# Altium schematic sheet power_load.SchDoc
size A2; SheetNumber: 1; SheetTotal: 2
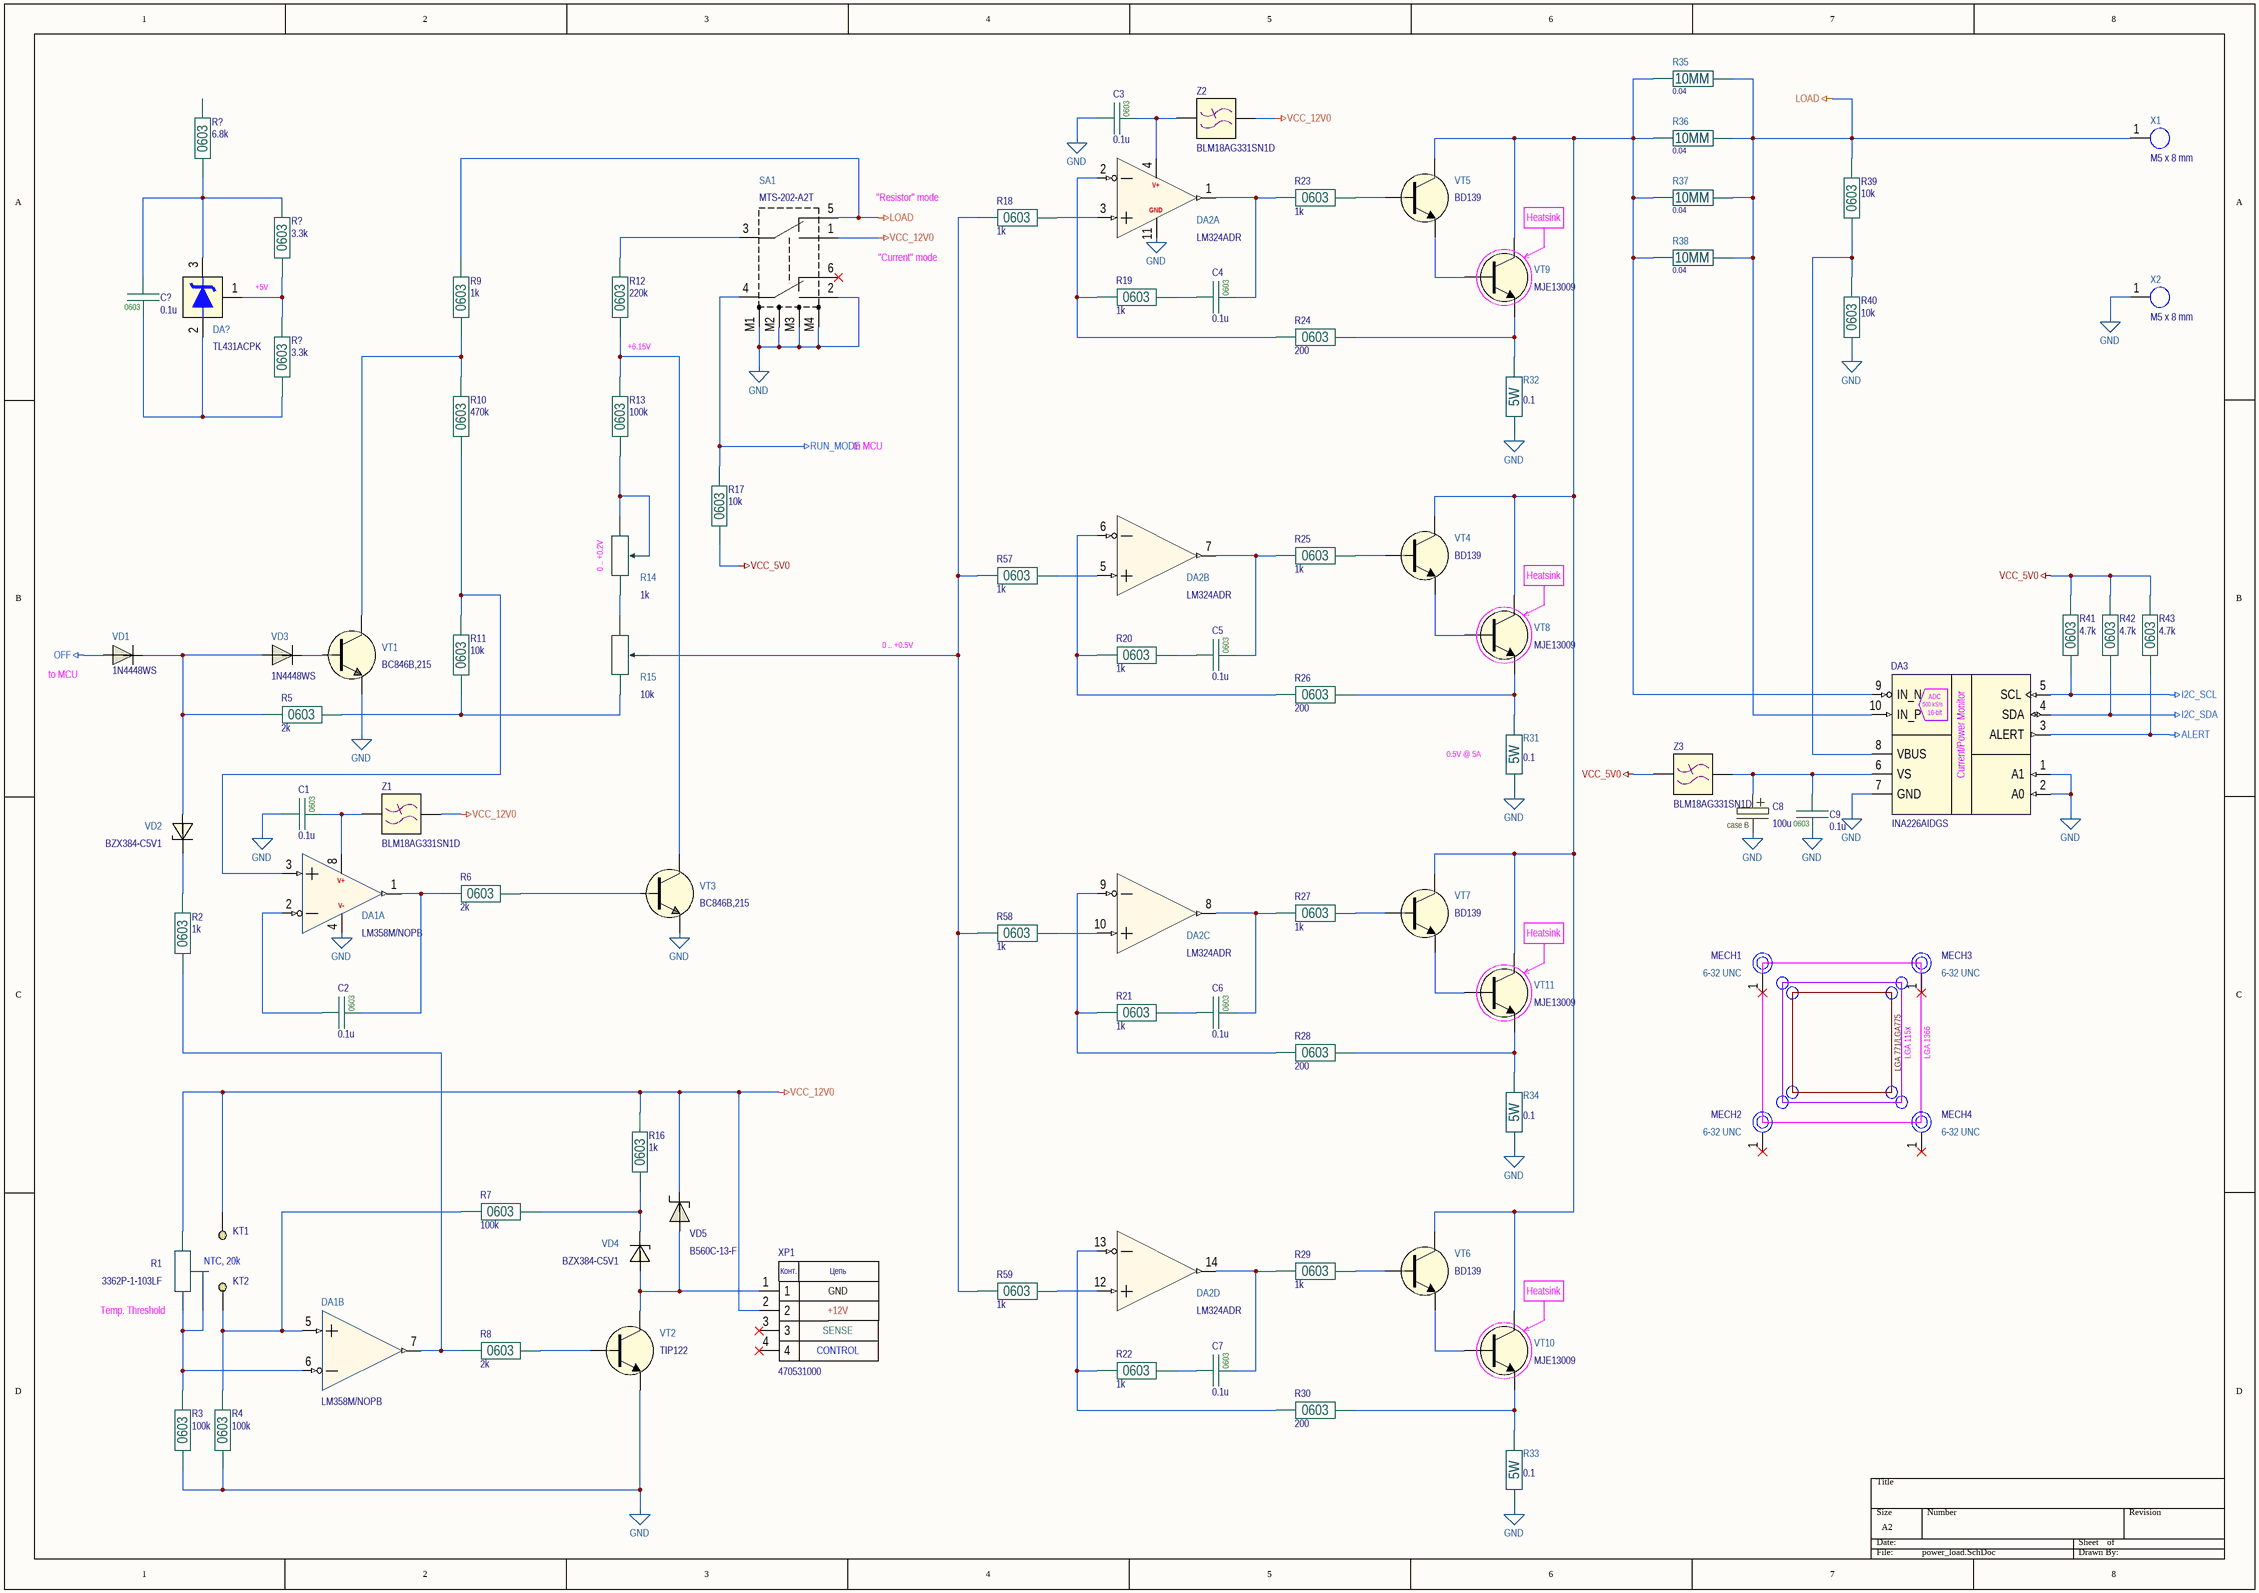
[diagram p0: power_load.SchDoc]

## Parts
(Parts that share a designator on the sheet are numbered #1, #2 ... from top to bottom, then left to right.)
C1  0.1u  Package: 0603  [CAP0603]
C2  0.1u  Package: 0603  [CAP0603]
C3  0.1u  Package: 0603  [CAP0603]
C4  0.1u  Package: 0603  [CAP0603]
C5  0.1u  Package: 0603  [CAP0603]
C6  0.1u  Package: 0603  [CAP0603]
C7  0.1u  Package: 0603  [CAP0603]
C8  100u  Package: case B  [CAP_CASE_B]
C9  0.1u  Package: 0603  [CAP0603]
C?  0.1u  Package: 0603  [CAP0603]
DA1  LM358M/NOPB  [SOIC-8]  (parts A,B of 2)
DA2  LM324ADR  [SOIC-14]  (parts A,B,C,D of 4)
DA3  INA226AIDGS  [VSSOP-10]
DA?  TL431ACPK  [SOT89-3]
KT1  TEST_PAD  [TEST_PAD_HOLE1.1x1.8]  (value not drawn)  (net tie, no BOM)
KT2  TEST_PAD  [TEST_PAD_HOLE1.1x1.8]  (value not drawn)  (net tie, no BOM)
MECH1  Thread: 6-32 UNC  [1612-2_SLOT]  (hidden comment: 1612-2)
MECH2  Thread: 6-32 UNC  [1612-2_SLOT]  (hidden comment: 1612-2)
MECH3  Thread: 6-32 UNC  [1612-2_SLOT]  (hidden comment: 1612-2)
MECH4  Thread: 6-32 UNC  [1612-2_SLOT]  (hidden comment: 1612-2)
R1  3362P-1-103LF  [3362P]
R2  1k  Package: 0603  [RES0603B]
R3  100k  Package: 0603  [RES0603B]
R4  100k  Package: 0603  [RES0603B]
R5  2k  Package: 0603  [RES0603B]
R6  2k  Package: 0603  [RES0603B]
R7  100k  Package: 0603  [RES0603B]
R8  2k  Package: 0603  [RES0603B]
R9  1k  Package: 0603  [RES0603B]
R10  470k  Package: 0603  [RES0603B]
R11  10k  Package: 0603  [RES0603B]
R12  220k  Package: 0603  [RES0603B]
R13  100k  Package: 0603  [RES0603B]
R14  value 1k  [PTV09A-4225F]  (hidden comment: PTV09A-4225F-B102)
R15  value 10k  [PTV09A-4225F]  (hidden comment: PTV09A-4225F-B103)
R16  1k  Package: 0603  [RES0603B]
R17  10k  Package: 0603  [RES0603C]
R18  1k  Package: 0603  [RES0603B]
R19  1k  Package: 0603  [RES0603B]
R20  1k  Package: 0603  [RES0603B]
R21  1k  Package: 0603  [RES0603B]
R22  1k  Package: 0603  [RES0603B]
R23  1k  Package: 0603  [RES0603B]
R24  200  Package: 0603  [RES0603B]
R25  1k  Package: 0603  [RES0603B]
R26  200  Package: 0603  [RES0603B]
R27  1k  Package: 0603  [RES0603B]
R28  200  Package: 0603  [RES0603B]
R29  1k  Package: 0603  [RES0603B]
R30  200  Package: 0603  [RES0603B]
R31  0.1  Package: 5W  [BPR58_HORIZONTAL]
R32  0.1  Package: 5W  [BPR58_HORIZONTAL]
R33  0.1  Package: 5W  [BPR58_HORIZONTAL]
R34  0.1  Package: 5W  [BPR58_HORIZONTAL]
R35  0.04  Package: 10MM  [CURRENT_SENSE_10x11mm]
R36  0.04  Package: 10MM  [CURRENT_SENSE_10x11mm]
R37  0.04  Package: 10MM  [CURRENT_SENSE_10x11mm]
R38  0.04  Package: 10MM  [CURRENT_SENSE_10x11mm]
R39  10k  Package: 0603  [RES0603C]
R40  10k  Package: 0603  [RES0603C]
R41  4.7k  Package: 0603  [RES0603B]
R42  4.7k  Package: 0603  [RES0603B]
R43  4.7k  Package: 0603  [RES0603B]
R57  1k  Package: 0603  [RES0603B]
R58  1k  Package: 0603  [RES0603B]
R59  1k  Package: 0603  [RES0603B]
R?#1  6.8k  Package: 0603  [RES0603B]
R?#2  3.3k  Package: 0603  [RES0603B]
R?#3  3.3k  Package: 0603  [RES0603B]
SA1  MTS-202-A2T  [MTS-202-A2T]
VD1  1N4448WS  [SOD-323F]
VD2  BZX384-C5V1  [SOD-323]
VD3  1N4448WS  [SOD-323F]
VD4  BZX384-C5V1  [SOD-323]
VD5  B560C-13-F  [DO-214AB]
VT1  BC846B,215  [SOT23-3]
VT2  TIP122  [TO-220AB-3]
VT3  BC846B,215  [SOT23-3]
VT4  BD139  [TO-126 (HORIZONTAL)]
VT5  BD139  [TO-126 (HORIZONTAL)]
VT6  BD139  [TO-126 (HORIZONTAL)]
VT7  BD139  [TO-126 (HORIZONTAL)]
VT8  MJE13009  [TO-3PN (HORIZONTAL, BOTTOM)]
VT9  MJE13009  [TO-3PN (HORIZONTAL, BOTTOM)]
VT10  MJE13009  [TO-3PN (HORIZONTAL, BOTTOM)]
VT11  MJE13009  [TO-3PN (HORIZONTAL, BOTTOM)]
X1  M5 x 8 mm  [STANDOFF_M5_8MM]
X2  M5 x 8 mm  [STANDOFF_M5_8MM]
XP1  470531000  [0470531000]
Z1  BLM18AG331SN1D  [BLM0603P]
Z2  BLM18AG331SN1D  [BLM0603P]
Z3  BLM18AG331SN1D  [BLM0603P]

## Nets
ALERT: DA3.3(ALERT) R43.1
GND: C1.2 C3.2 C8.2 C9.2 DA1.4(V-) DA2.11(GND) DA3.1(A1) DA3.2(A0) DA3.7(GND) R3.1 R4.1 R31.1 R32.1 R33.1 R34.1 R40.2 SA1.2 SA1.M1 SA1.M2 SA1.M3 SA1.M4 VT1.2(E) VT2.3(E) VT3.2(E) X2.1
I2C_SCL: DA3.5(SCL) R41.1
I2C_SDA: DA3.4(SDA) R42.1
LOAD: DA3.10(IN_P) R9.2 R35.2 R36.2 R37.2 R38.2 R39.1 SA1.5 X1.1
OFF: VD1.2(A)
RUN_MODE: R17.1 SA1.4
VCC_5V0: R17.2 R41.2 R42.2 R43.2 Z3.1
VCC_12V0: KT1.1 R1.1 R16.2 SA1.1 VD5.2(C) XP1.2 Z1.2 Z2.2
NetC1_1: C1.1 DA1.8(V+) Z1.1
NetC2_1: C2.1 DA1.1(1OUT) R6.1
NetC2_2: C2.2 DA1.2(1IN-)
NetC3_1: C3.1 DA2.4(VCC) Z2.1
NetC4_1: C4.1 DA2.1(1OUT) R23.1
NetC4_2: C4.2 R19.2
NetC5_1: C5.1 DA2.7(2OUT) R25.1
NetC5_2: C5.2 R20.2
NetC6_1: C6.1 DA2.8(3OUT) R27.1
NetC6_2: C6.2 R21.2
NetC7_1: C7.1 DA2.14(4OUT) R29.1
NetC7_2: C7.2 R22.2
NetC8_1: C8.1 C9.1 DA3.6(VS) Z3.2
NetC?_1: C?.1 DA?.3(CATHODE) R?#1.1 R?#2.2
NetC?_2: C?.2 DA?.2(ANODE) R?#3.1
NetDA1_3: DA1.3(1IN+) R10.1 R11.2
NetDA1_5: DA1.5(2IN+) KT2.1 R4.2 R7.2
NetDA1_6: DA1.6(2IN-) R1.2 R1.3 R3.2
NetDA1_7: DA1.7(2OUT) R2.1 R8.1
NetDA2_2: DA2.2(1IN-) R19.1 R24.1
NetDA2_3: DA2.3(1IN+) R18.2
NetDA2_5: DA2.5(2IN+) R57.2
NetDA2_6: DA2.6(2IN-) R20.1 R26.1
NetDA2_9: DA2.9(3IN-) R21.1 R28.1
NetDA2_10: DA2.10(3IN+) R58.2
NetDA2_12: DA2.12(4IN+) R59.2
NetDA2_13: DA2.13(4IN-) R22.1 R30.1
NetDA3_8: DA3.8(VBUS) R39.2 R40.1
NetDA3_9: DA3.9(IN_N) R35.1 R36.1 R37.1 R38.1 VT4.2(C) VT5.2(C) VT6.2(C) VT7.2(C) VT8.2(C) VT9.2(C) VT10.2(C) VT11.2(C)
NetDA?_1: DA?.1(REF) R?#2.1 R?#3.2
NetR2_2: R2.2 VD2.1
NetR5_1: R5.1 VD1.1(C) VD2.2 VD3.2(A)
NetR5_2: R5.2 R11.1 R15.1
NetR6_2: R6.2 VT3.1(B)
NetR7_1: R7.1 R16.1 VD4.1
NetR8_2: R8.2 VT2.1(B)
NetR9_1: R9.1 R10.2 VT1.3(C)
NetR12_1: R12.1 R13.2 VT3.3(C)
NetR12_2: R12.2 SA1.3
NetR13_1: R13.1 R14.2 R14.3
NetR14_1: R14.1 R15.3
NetR15_2: R15.2 R18.1 R57.1 R58.1 R59.1
NetR23_2: R23.2 VT5.1(B)
NetR24_2: R24.2 R32.2 VT9.3(E)
NetR25_2: R25.2 VT4.1(B)
NetR26_2: R26.2 R31.2 VT8.3(E)
NetR27_2: R27.2 VT7.1(B)
NetR28_2: R28.2 R34.2 VT11.3(E)
NetR29_2: R29.2 VT6.1(B)
NetR30_2: R30.2 R33.2 VT10.3(E)
NetVD3_1: VD3.1(C) VT1.1(B)
NetVD4_2: VD4.2 VD5.1(A) VT2.2(C) XP1.1
NetVT4_3: VT4.3(E) VT8.1(B)
NetVT5_3: VT5.3(E) VT9.1(B)
NetVT6_3: VT6.3(E) VT10.1(B)
NetVT7_3: VT7.3(E) VT11.1(B)

Not connected (* = marked no-connect by the designer): MECH1 1*; MECH2 1*; MECH3 1*; MECH4 1*; R?#1 2; SA1 6*; XP1 3* 4*

## Notes on the sheet
- "Resistor" mode
- (near VT9) Heatsink
- +5V
- "Current" mode
- (near R12) +6.15V
- to MCU
- (near R14) 0 .. +0.2V
- (near VT8) Heatsink
- 0 .. +0.5V
- (near R31) 0.5V @ 5A
- (near VT11) Heatsink
- LGA 771/LGA775
- LGA 115x
- LGA 1366
- (near R1) Temp. Threshold
- (near R1) NTC, 20k
- (near VT10) Heatsink
- (in symbol 470531000) Конт.; Цепь; GND; +12V; SENSE; CONTROL
- (in symbol INA226AIDGS) ADC; 500 kS/s; 16-bit; Current/Power Monitor
- (in symbol LM324ADR, part A) V+

## Library data of the parts
C1-C7 C9 C? = C0603: Capacitors 0603 package case; Part Number: CL10B104KB8NNNC; Manufacturer: Samsung Sdi Co. Ltd; Tolerance: ± 10 %; Dielectric: X7R; Voltage: 50V; Value: 0.1u; Value on schem: 0.1u
C8 = C_CASEB: Tantalum capacitors case B; Part Number: 293D107X0010B2TE3; Manufacturer: Vishay Intertechnology Inc.; Tolerance: ± 10 %; Voltage: 10V; ESR: 2.5Ohm @ 100 kHz; Value: 100u; Value on schem: 100u; Series: 293D
DA1 = LM358M/NOPB: Low-Power, Dual-Operational Amplifiers; Manufacturer: Texas Instruments; Part Number: LM358M/NOPB; Package: SOIC-8
DA2 = LM324ADR: Low Power Quad Operational Amplifiers; Manufacturer: Texas Instruments; Part Number: LM324ADR; Package: SOIC-14
DA3 = INA226AIDGS: High-Side or Low-Side Measurement, / Bi-Directional Current and Power Monitor with I / 2C Compatible Interface; Manufacturer: Texas Instruments; Part Number: INA226AIDGS; Package: VSSOP-10
DA? = TL431ACPK: Precision Programmable Reference; Manufacturer: Texas Instruments; Part Number: TL431ACPK; Package: SOT-89
KT1 KT2 = TEST_PAD: Test pad
MECH1-MECH4 = 1612-2: Swage Threaded Standoffs 6-32 Thread x 0.250, H = 0.187; Manufacturer: Keystone; Part Number: 1612-2
R1 = 3362P-1-103LF: TRIMMER 10K OHM 0.5W PC PIN TOP; Manufacturer: Bourns Inc.; Part Number: 3362P-1-103LF; Power Dissipation: 0.5W; Value: 10k
R2 R9 R16 R18-R23 R25 R27 R29 R57-R59 = R0603: Resistor 0603 package case; Part Number: RC0603FR-071KL; Manufacturer: Yageo; Tolerance: ± 1 %; Temperature coefficient: ± 100 ppm/°C; Voltage: 75V; Value: 1k; Value on schem: 1k
R3 R4 R7 R13 = R0603: Resistor 0603 package case; Part Number: RC0603FR-07100KL; Manufacturer: Yageo; Tolerance: ± 1 %; Temperature coefficient: ± 100 ppm/°C; Voltage: 75V; Value: 100k; Value on schem: 100k
R5 R6 R8 = R0603: Resistor 0603 package case; Part Number: RC0603FR-072KL; Manufacturer: Yageo; Tolerance: ± 1 %; Temperature coefficient: ± 100 ppm/°C; Voltage: 75V; Value: 2k; Value on schem: 2k
R10 = R0603: Resistor 0603 package case; Part Number: RC0603FR-07470KL; Manufacturer: Yageo; Tolerance: ± 1 %; Temperature coefficient: ± 100 ppm/°C; Voltage: 75V; Value: 470k; Value on schem: 470k
R11 = R0603: Resistor 0603 package case; Part Number: RC0603FR-0710KL; Manufacturer: Yageo; Tolerance: ± 1 %; Temperature coefficient: ± 100 ppm/°C; Voltage: 75V; Value: 10k; Value on schem: 10k
R12 = R0603: Resistor 0603 package case; Part Number: RC0603FR-07220KL; Manufacturer: Yageo; Tolerance: ± 1 %; Temperature coefficient: ± 100 ppm/°C; Voltage: 75V; Value: 220k; Value on schem: 220k
R14 = PTV09A-4225F-B102: 1 kOhm Potentiometer; Manufacturer: Bourns Inc.; Power Dissipation: 0.05W; Part Number: PTV09A-4225F-B102
R15 = PTV09A-4225F-B103: 10 kOhm Potentiometer; Manufacturer: Bourns Inc.; Power Dissipation: 0.05W; Part Number: PTV09A-4225F-B103
R17 R39 R40 = R0603: Resistor 0603 package case; Part Number: ERA3AEB103V; Manufacturer: Matsushita; Tolerance: ± 0.1 %; Temperature coefficient: ± 25 ppm/°C; Voltage: 75V; Value: 10k; Value on schem: 10k
R24 R26 R28 R30 = R0603: Resistor 0603 package case; Part Number: RC0603FR-07200RL; Manufacturer: Yageo; Tolerance: ± 1 %; Temperature coefficient: ± 100 ppm/°C; Voltage: 75V; Value: 200; Value on schem: 200
R31-R34 = BPR58: Rectangular type metal plate resistors; Part Number: BPR58CR10J; Manufacturer: KOA Speer; Tolerance: ± 5 %; Temperature Coefficient: ±350 /°C; Value: 0.1; Value on schem: 0.1
R35-R38 = SHUNT_10MM: Constantan shunt resistor, pitch = 10mm; Tolerance: ±  %; Temperature Coefficient: ±*/°C; Value: 0.04; Value on schem: 0.04; Part Number: *; Manufacturer: *; Voltage: *
R41-R43 = R0603: Resistor 0603 package case; Part Number: RC0603FR-074K7L; Manufacturer: Yageo; Tolerance: ± 1 %; Temperature coefficient: ± 100 ppm/°C; Voltage: 75V; Value: 4.7k; Value on schem: 4.7k
R?#1 = R0603: Resistor 0603 package case; Part Number: RC0603FR-076K8L; Manufacturer: Yageo; Tolerance: ± 1 %; Temperature coefficient: ± 100 ppm/°C; Voltage: 75V; Value: 6.8k; Value on schem: 6.8k
R?#2 R?#3 = R0603: Resistor 0603 package case; Part Number: RC0603FR-073K3L; Manufacturer: Yageo; Tolerance: ± 1 %; Temperature coefficient: ± 100 ppm/°C; Voltage: 75V; Value: 3.3k; Value on schem: 3.3k
SA1 = MTS-202-A2T: Switch; Manufacturer: RUICHI; Part Number: MTS-202-A2T
VD1 VD3 = 1N4448WS: Diode 75V, 150mA; Manufacturer: ON Semiconductor; Package: SOD-323F; Part Number: 1N4448WS
VD2 VD4 = BZX384-C5V1: Voltage regulator diodes 5.1V; Package: SOD-323; Part Number: BZX384-C5V1
VD5 = B560C-13-F: Diode Schottky 60V, 5A; Manufacturer: Diodes Incorporated; Package: SMC/DO-214AB; Part Number: B560C-13-F
VT1 VT3 = BC846B,215: General Purpose n-p-n Transistors; Manufacturer: Nexperia USA Inc.; Package: SOT23-3; Part Number: BC846B,215
VT2 = TIP122: Power Darlington Transistor; Manufacturer: STMicroelectronics; Package: TO-220; Part Number: TIP122
VT4-VT7 = BD139: General Purpose n-p-n Transistors; Manufacturer: STMicroelectronics; Package: TO-126; Part Number: BD139
VT8-VT11 = MJE13009: General Purpose n-p-n Transistors 400V, 12A, 100W; Manufacturer: Inchange Semiconductor; Package: TO-220A; Part Number: MJE13009
X1 X2 = STANDOFF_M5_8MM: Standoffs M5 Thread x 0.8, H = 8 mm; Part Number: M5 x 8 mm; Thread: M5
XP1 = 470531000: Designator: XP*; Part Number: 470531000
Z1-Z3 = BLM18AG331SN1D: Power line filter, imperdance 330 Ohm (current 05A); Part Number: BLM18AG331SN1D; Package: 0603